# Altium schematic sheet 2_Input.SchDoc
size A4; SheetNumber: 2; SheetTotal: 5
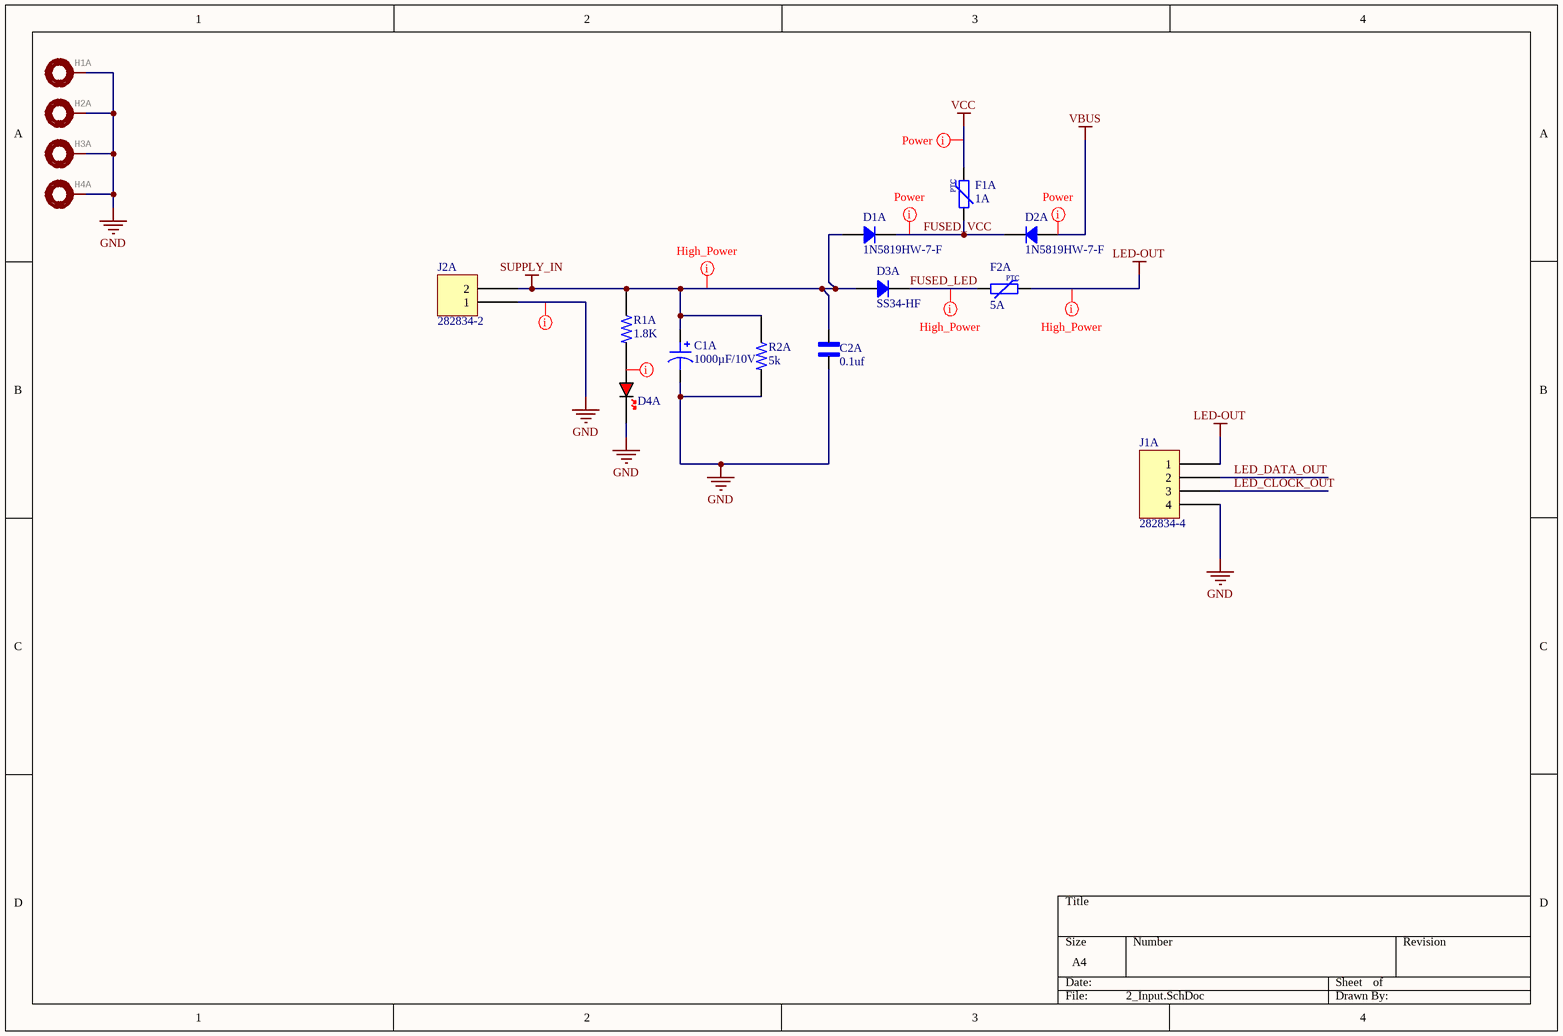
[diagram p0: 2_Input.SchDoc]

## Parts
C1A  1000µF/10V  [CAP TH ALUM ELEC D8.00mm S3.50mm H13.00mm]
C2A  0.1uf  [C-0603]
D1A  1N5819HW-7-F  [SOD-123]
D2A  1N5819HW-7-F  [SOD-123]
D3A  SS34-HF  [DO214AC SMA]
D4A  RED  [LED_0603_RED]  (value not drawn)
F1A  1A  [FUSE_1206]
F2A  5A  [FUSE_1206]
H1A  MOUNTING PAD, round  [2,8-PAD]  (value not drawn)
H2A  MOUNTING PAD, round  [2,8-PAD]  (value not drawn)
H3A  MOUNTING PAD, round  [2,8-PAD]  (value not drawn)
H4A  MOUNTING PAD, round  [2,8-PAD]  (value not drawn)
J1A  282834-4  [TE 282834-4]
J2A  282834-2  [TE 282834-2]
R1A  1.8K  [R-0603]
R2A  5k  [R-0603]

## Nets
GND: C1A.2 C2A.1 D4A.K H1A.1(MOUNT) H2A.1(MOUNT) H3A.1(MOUNT) H4A.1(MOUNT) J1A.4 J2A.1 R2A.2
LED-OUT: F2A.2 J1A.1
SUPPLY_IN: C1A.1 C2A.2 D1A.1 D3A.1 J2A.2 R1A.1 R2A.1
VBUS: D2A.1
VCC: F1A.2
FUSED_LED: D3A.2 F2A.1
FUSED_VCC: D1A.2 D2A.2 F1A.1
LED_CLOCK_OUT: J1A.3
LED_DATA_OUT: J1A.2
NetD4A_A: D4A.A R1A.2

## Layout directives
net class Power; rule Supply Nets [Voltage = 0.000]: FUSED_VCC, VBUS, VCC
net class Signal: NetD4A_A
net class GND; rule Supply Nets [Voltage = 0.000]: GND
net class High_Power; rule Supply Nets [Voltage = 0.000]: FUSED_LED, LED-OUT, SUPPLY_IN

## Notes on the sheet
- (in symbol FUSE_PPTC_1206) PTC

## Library data of the parts
C1A = 10PK1000MEFC8X11.5: CAP ALUM 1000UF 20% 10V RADIAL; manufacturer: Rubycon; Capacitance: 1000µF; Lifetime @ Temp.: 2000 Hrs @ 85°C; Polarization: Polar; Ripple Current @ High Frequency: 792mA @ 10kHz; Ripple Current @ Low Frequency: 660mA @ 120Hz; Part Number: 10PK1000MEFC8X11.5; Applications: General Purpose; componentlink1description: Datasheet; componentlink1url: http://www.rubycon.co.jp/en/catalog/e_pdfs/aluminum/e_pk.pdf; componentlink2description: DigiKey Link; componentlink2url: http://digikey.com/product-detail/en/rubycon/10PK1000MEFC8X11.5/1189-1050-ND/3133980; Device Package: Radial, Can; Height - Seated (Max): 0.512" (13.00mm); lastupdated: 07-09-2020 05:24:54 AM; Lead Spacing: 0.138" (3.50mm); Lifecycle Status: Active; Minimum Order: 1; Mounting Type: Through Hole; Operating Temperature: -40°C ~ 85°C; Package / Case: Radial, Can; packaging: Bulk; partid: 23938; Part Status: Active; price: 0.34; series: PK; Size / Dimension: 0.315" Dia (8.00mm); Supplier 1: DigiKey; Supplier Part Number 1: 1189-1050-ND; Tolerance: ±20%; value: 1000µF/10V; Voltage - Rated: 10V
C2A = C-0603: Ceramic Capacitor 16V 0603 (1608 Metric); MP: C0603C104J4RAC; MF: KEMET; SnapEDA_Link: https://www.snapeda.com/parts/C0603C104J4RAC/KEMET/view-part/1763758/?ref=snap; Availability: Warning; Package: 0603 KEMET; Check_prices: https://www.snapeda.com/parts/C0603C104J4RAC/KEMET/view-part/1763758/?ref=eda; Value: *; Price: None
D1A D2A = 1N5819HW-7-F: DIODE SCHOTTKY 40V 1A SOD123; Manufacturer: Diodes Incorporated; Capacitance @ Vr, F: 60pF @ 4V, 1MHz; Current - Reverse Leakage @ Vr: 1mA @ 40V; Speed: Fast Recovery =< 500ns, > 200mA (Io); Voltage - Forward (Vf) (Max) @ If: 450mV @ 1A; Part Number: 1N5819HW-7-F; ComponentLink1Description: Datasheet; ComponentLink1URL: https://www.diodes.com/assets/Datasheets/ds30217.pdf; ComponentLink2Description: DigiKey Link; ComponentLink2URL: http://digikey.com/product-detail/en/diodes-incorporated/1N5819HW-7-F/1N5819HW-FDICT-ND/815283; Current - Average Rectified (Io): 1A; Diode Type: Schottky; LastUpdated: 19-09-2022 13:46:25; Lifecycle Status: Active; Minimum Order: 1; Mounting Type: Surface Mount; Operating Temperature - Junction: -65°C ~ 125°C; Package / Case: SOD-123; Packaging: TapeAndReel; PartId: 2212; Part Status: Active; Price: 0.08; Series: -; Supplier 1: DigiKey; Supplier Part Number 1: 1N5819HW-FDICT-ND; Supplier Device Package: SOD-123; Voltage - DC Reverse (Vr) (Max): 40V
D3A = SS34-HF: DIODE SCHOTTKY 40V 3A DO214AC SM; Manufacturer: Comchip Technology; Capacitance @ Vr, F: 450pF @ 4V, 1MHz; Current - Reverse Leakage @ Vr: 500 µA @ 40 V; Speed: Fast Recovery =< 500ns, > 200mA (Io); Voltage - Forward (Vf) (Max) @ If: 550 mV @ 3 A; Part Number: SS34-HF; ComponentLink1Description: Datasheet; ComponentLink1URL: http://www.comchiptech.com/admin/files/product/20190514101641.pdf; ComponentLink2Description: DigiKey Link; ComponentLink2URL: https://www.digikey.com/en/products/detail/comchip-technology/SS34-HF/10279693; Current - Average Rectified (Io): 3A; Diode Type: Schottky; LastUpdated: 19-09-2022 01:46:08 PM; Lifecycle Status: Active; Minimum Order: 1; Mounting Type: Surface Mount; Operating Temperature - Junction: -55°C ~ 125°C; Package / Case: DO-214AC, SMA; Packaging: TapeAndReel; PartId: 2138; Part Status: Active; Price: 0.07; Series: -; Supplier 1: DigiKey; Supplier Part Number 1: 641-2115-1-ND; Supplier Device Package: DO-214AC (SMA); Voltage - DC Reverse (Vr) (Max): 40 V
D4A = LED_0603_RED: LED 0603 RED SMD
F1A F2A = FUSE_PPTC_1206: Fuse PPTC SMD 1206; Manufacturer: *; Manufacturer Part Number: *
H1A H2A H3A H4A = MOUNT-PAD-ROUND2.8: GateName_1: G$1; DeviceName: 2.8; POPULARITY: 6; SymbolName_1: MOUNT-PAD; LibraryName: Holes-Custom; DeviceSetName: MOUNT-PAD-ROUND; Package: 2,8-PAD
J1A = 282834-4: TERM BLK 4P SIDE ENT 2.54MM PCB; Manufacturer: TE Connectivity AMP Connectors; Pitch: 0.100" (2.54mm); Current: 10A; Mating Orientation: Horizontal with Board; Number of Levels: 1; Positions Per Level: 4; Voltage: 150V; Wire Gauge: 16-30 AWG; Wire Termination: Screw - Rising Cage Clamp; Packaging: Bulk; Part Number: 282834-4; Color: Green; ComponentLink1Description: Datasheet; ComponentLink1URL: https://www.te.com/commerce/DocumentDelivery/DDEController?Action=srchrtrv&DocNm=282834&DocType=Customer+Drawing&DocLang=English; ComponentLink2Description: DigiKey Link; ComponentLink2URL: http://digikey.com/product-detail/en/te-connectivity-amp-connectors/282834-4/A98335-ND/1153265; LastUpdated: 15-01-2020 04:16:05 AM; Lifecycle Status: Active; Minimum Order: 1; Mounting Type: Through Hole; Part Status: Active; Price: 2.68; Series: Buchanan; Supplier 1: DigiKey; Supplier Part Number 1: A98335-ND
J2A = 282834-2: TERM BLK 2P SIDE ENT 2.54MM PCB; Manufacturer: TE Connectivity AMP Connectors; Pitch: 0.100" (2.54mm); Current: 10A; Mating Orientation: Horizontal with Board; Number of Levels: 1; Positions Per Level: 2; Voltage: 150V; Wire Gauge: 16-30 AWG; Wire Termination: Screw - Rising Cage Clamp; Packaging: Bulk; Part Number: 282834-2; Color: Green; ComponentLink1Description: Datasheet; ComponentLink1URL: https://www.te.com/commerce/DocumentDelivery/DDEController?Action=srchrtrv&DocNm=282834&DocType=Customer+Drawing&DocLang=English; ComponentLink2Description: DigiKey Link; ComponentLink2URL: http://digikey.com/product-detail/en/te-connectivity-amp-connectors/282834-2/A98333-ND/1150135; LastUpdated: 15-01-2020 04:15:38 AM; Lifecycle Status: Active; Minimum Order: 1; Mounting Type: Through Hole; Part Status: Active; Price: 0.88; Series: Buchanan; Supplier 1: DigiKey; Supplier Part Number 1: A98333-ND
R1A R2A = R-0603: 0603; MP: 2-1623703-0; Power_Rating: .1 W; Value: 10K; Tolerance: 1%; MF: TE Connectivity; Package: 0603; Price: None; Resistance: 10K; Check_prices: https://www.snapeda.com/parts/2-1623703-0/TE%20Connectivity/view-part/2213192/?ref=eda; SnapEDA_Link: https://www.snapeda.com/parts/2-1623703-0/TE%20Connectivity/view-part/2213192/?ref=snap; Availability: Warning